# Altium schematic sheet FPGA Power.SchDoc
size A4
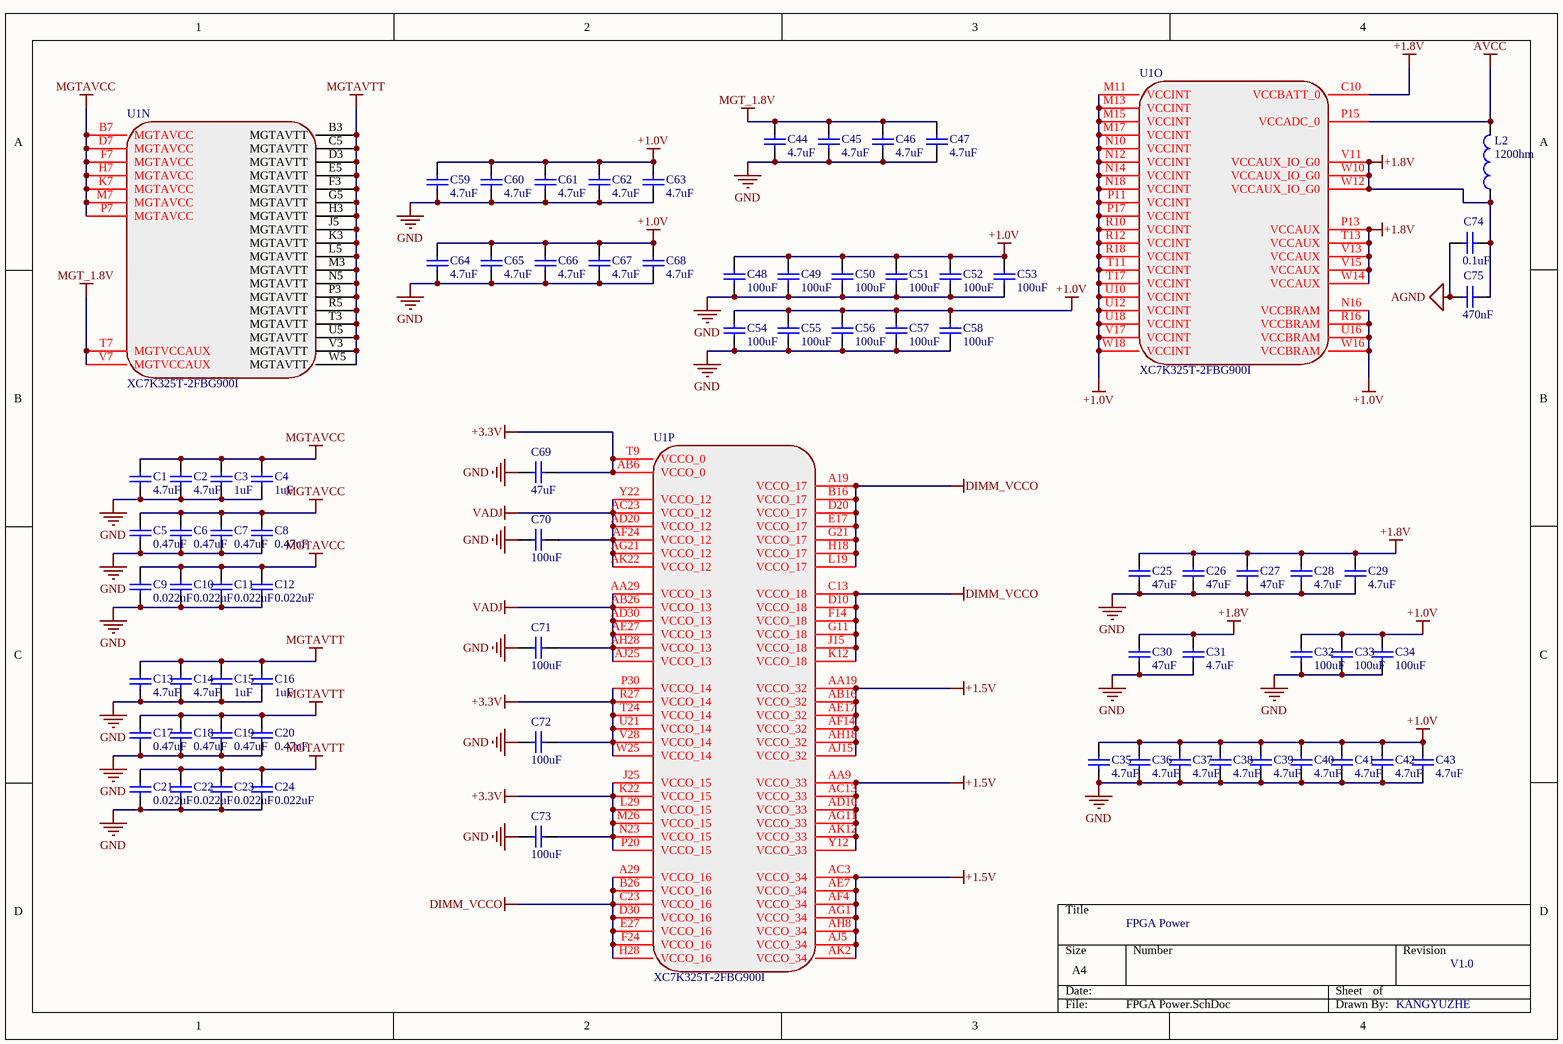
[diagram p0: FPGA Power.SchDoc]

## Parts
C1  value 4.7uF  [0402]  (hidden comment: Cap Semi)
C2  value 4.7uF  [0402]  (hidden comment: Cap Semi)
C3  value 1uF  [0402]  (hidden comment: Cap Semi)
C4  value 1uF  [0402]  (hidden comment: Cap Semi)
C5  value 0.47uF  [0402]  (hidden comment: Cap Semi)
C6  value 0.47uF  [0402]  (hidden comment: Cap Semi)
C7  value 0.47uF  [0402]  (hidden comment: Cap Semi)
C8  value 0.47uF  [0402]  (hidden comment: Cap Semi)
C9  value 0.022uF  [0402]  (hidden comment: Cap Semi)
C10  value 0.022uF  [0402]  (hidden comment: Cap Semi)
C11  value 0.022uF  [0402]  (hidden comment: Cap Semi)
C12  value 0.022uF  [0402]  (hidden comment: Cap Semi)
C13  value 4.7uF  [0402]  (hidden comment: Cap Semi)
C14  value 4.7uF  [0402]  (hidden comment: Cap Semi)
C15  value 1uF  [0402]  (hidden comment: Cap Semi)
C16  value 1uF  [0402]  (hidden comment: Cap Semi)
C17  value 0.47uF  [0402]  (hidden comment: Cap Semi)
C18  value 0.47uF  [0402]  (hidden comment: Cap Semi)
C19  value 0.47uF  [0402]  (hidden comment: Cap Semi)
C20  value 0.47uF  [0402]  (hidden comment: Cap Semi)
C21  value 0.022uF  [0402]  (hidden comment: Cap Semi)
C22  value 0.022uF  [0402]  (hidden comment: Cap Semi)
C23  value 0.022uF  [0402]  (hidden comment: Cap Semi)
C24  value 0.022uF  [0402]  (hidden comment: Cap Semi)
C25  value 47uF  [0402]  (hidden comment: Cap Semi)
C26  value 47uF  [0402]  (hidden comment: Cap Semi)
C27  value 47uF  [0402]  (hidden comment: Cap Semi)
C28  value 4.7uF  [0402]  (hidden comment: Cap Semi)
C29  value 4.7uF  [0402]  (hidden comment: Cap Semi)
C30  value 47uF  [0402]  (hidden comment: Cap Semi)
C31  value 4.7uF  [0402]  (hidden comment: Cap Semi)
C32  value 100uF  [0402]  (hidden comment: Cap Semi)
C33  value 100uF  [0402]  (hidden comment: Cap Semi)
C34  value 100uF  [0402]  (hidden comment: Cap Semi)
C35  value 4.7uF  [0402]  (hidden comment: Cap Semi)
C36  value 4.7uF  [0402]  (hidden comment: Cap Semi)
C37  value 4.7uF  [0402]  (hidden comment: Cap Semi)
C38  value 4.7uF  [0402]  (hidden comment: Cap Semi)
C39  value 4.7uF  [0402]  (hidden comment: Cap Semi)
C40  value 4.7uF  [0402]  (hidden comment: Cap Semi)
C41  value 4.7uF  [0402]  (hidden comment: Cap Semi)
C42  value 4.7uF  [0402]  (hidden comment: Cap Semi)
C43  value 4.7uF  [0402]  (hidden comment: Cap Semi)
C44  value 4.7uF  [0402]  (hidden comment: Cap Semi)
C45  value 4.7uF  [0402]  (hidden comment: Cap Semi)
C46  value 4.7uF  [0402]  (hidden comment: Cap Semi)
C47  value 4.7uF  [0402]  (hidden comment: Cap Semi)
C48  value 100uF  [0402]  (hidden comment: Cap Semi)
C49  value 100uF  [0402]  (hidden comment: Cap Semi)
C50  value 100uF  [0402]  (hidden comment: Cap Semi)
C51  value 100uF  [0402]  (hidden comment: Cap Semi)
C52  value 100uF  [0402]  (hidden comment: Cap Semi)
C53  value 100uF  [0402]  (hidden comment: Cap Semi)
C54  value 100uF  [0402]  (hidden comment: Cap Semi)
C55  value 100uF  [0402]  (hidden comment: Cap Semi)
C56  value 100uF  [0402]  (hidden comment: Cap Semi)
C57  value 100uF  [0402]  (hidden comment: Cap Semi)
C58  value 100uF  [0402]  (hidden comment: Cap Semi)
C59  value 4.7uF  [0402]  (hidden comment: Cap Semi)
C60  value 4.7uF  [0402]  (hidden comment: Cap Semi)
C61  value 4.7uF  [0402]  (hidden comment: Cap Semi)
C62  value 4.7uF  [0402]  (hidden comment: Cap Semi)
C63  value 4.7uF  [0402]  (hidden comment: Cap Semi)
C64  value 4.7uF  [0402]  (hidden comment: Cap Semi)
C65  value 4.7uF  [0402]  (hidden comment: Cap Semi)
C66  value 4.7uF  [0402]  (hidden comment: Cap Semi)
C67  value 4.7uF  [0402]  (hidden comment: Cap Semi)
C68  value 4.7uF  [0402]  (hidden comment: Cap Semi)
C69  value 47uF  [0402]  (hidden comment: Cap Semi)
C70  value 100uF  [0402]  (hidden comment: Cap Semi)
C71  value 100uF  [0402]  (hidden comment: Cap Semi)
C72  value 100uF  [0402]  (hidden comment: Cap Semi)
C73  value 100uF  [0402]  (hidden comment: Cap Semi)
C74  value 0.1uF  [0402]  (hidden comment: Cap Semi)
C75  value 470nF  [0402]  (hidden comment: Cap Semi)
L2  value 1200hm  [0402-A]  (hidden comment: Inductor)
U1  XC7K325T-2FBG900I  (parts N,O,P of 17)

## Nets
+1.0V: C32.2 C33.2 C34.2 C35.2 C36.2 C37.2 C38.2 C39.2 C40.2 C41.2 C42.2 C43.2 C48.2 C49.2 C50.2 C51.2 C52.2 C53.2 C54.2 C55.2 C56.2 C57.2 C58.2 C59.2 C60.2 C61.2 C62.2 C63.2 C64.2 C65.2 C66.2 C67.2 C68.2 U1.M11(VCCINT) U1.M13(VCCINT) U1.M15(VCCINT) U1.M17(VCCINT) U1.N10(VCCINT) U1.N12(VCCINT) U1.N14(VCCINT) U1.N16(VCCBRAM) U1.N18(VCCINT) U1.P11(VCCINT) U1.P17(VCCINT) U1.R10(VCCINT) U1.R12(VCCINT) U1.R16(VCCBRAM) U1.R18(VCCINT) U1.T11(VCCINT) U1.T17(VCCINT) U1.U10(VCCINT) U1.U12(VCCINT) U1.U16(VCCBRAM) U1.U18(VCCINT) U1.V17(VCCINT) U1.W16(VCCBRAM) U1.W18(VCCINT)
+1.5V: U1.AA9(VCCO_33) U1.AA19(VCCO_32) U1.AB16(VCCO_32) U1.AC3(VCCO_34) U1.AC13(VCCO_33) U1.AD10(VCCO_33) U1.AE7(VCCO_34) U1.AE17(VCCO_32) U1.AF4(VCCO_34) U1.AF14(VCCO_32) U1.AG1(VCCO_34) U1.AG11(VCCO_33) U1.AH8(VCCO_34) U1.AH18(VCCO_32) U1.AJ5(VCCO_34) U1.AJ15(VCCO_32) U1.AK2(VCCO_34) U1.AK12(VCCO_33) U1.Y12(VCCO_33)
+1.8V: C25.2 C26.2 C27.2 C28.2 C29.2 C30.2 C31.2 C74.2 C75.2 L2.1 U1.C10(VCCBATT_0) U1.P13(VCCAUX) U1.T13(VCCAUX) U1.V11(VCCAUX_IO_G0) U1.V13(VCCAUX) U1.V15(VCCAUX) U1.W10(VCCAUX_IO_G0) U1.W12(VCCAUX_IO_G0) U1.W14(VCCAUX)
+3.3V: C69.2 C72.2 C73.2 U1.AB6(VCCO_0) U1.J25(VCCO_15) U1.K22(VCCO_15) U1.L29(VCCO_15) U1.M26(VCCO_15) U1.N23(VCCO_15) U1.P20(VCCO_15) U1.P30(VCCO_14) U1.R27(VCCO_14) U1.T9(VCCO_0) U1.T24(VCCO_14) U1.U21(VCCO_14) U1.V28(VCCO_14) U1.W25(VCCO_14)
AGND: C74.1 C75.1
AVCC: L2.2 U1.P15(VCCADC_0)
DIMM_VCCO: U1.A19(VCCO_17) U1.A29(VCCO_16) U1.B16(VCCO_17) U1.B26(VCCO_16) U1.C13(VCCO_18) U1.C23(VCCO_16) U1.D10(VCCO_18) U1.D20(VCCO_17) U1.D30(VCCO_16) U1.E17(VCCO_17) U1.E27(VCCO_16) U1.F14(VCCO_18) U1.F24(VCCO_16) U1.G11(VCCO_18) U1.G21(VCCO_17) U1.H18(VCCO_17) U1.H28(VCCO_16) U1.J15(VCCO_18) U1.K12(VCCO_18) U1.L19(VCCO_17)
GND: C1.2 C2.1 C3.1 C4.1 C5.1 C6.1 C7.1 C8.1 C9.1 C10.1 C11.1 C12.1 C13.2 C14.1 C15.1 C16.1 C17.1 C18.1 C19.1 C20.1 C21.1 C22.1 C23.1 C24.1 C25.1 C26.1 C27.1 C28.1 C29.1 C30.1 C31.1 C32.1 C33.1 C34.1 C35.1 C36.1 C37.1 C38.1 C39.1 C40.1 C41.1 C42.1 C43.1 C44.1 C45.1 C46.1 C47.1 C48.1 C49.1 C50.1 C51.1 C52.1 C53.1 C54.1 C55.1 C56.1 C57.1 C58.1 C59.1 C60.1 C61.1 C62.1 C63.1 C64.1 C65.1 C66.1 C67.1 C68.1 C69.1 C70.1 C71.1 C72.1 C73.1
MGT_1.8V: C44.2 C45.2 C46.2 C47.2 U1.T7(MGTVCCAUX) U1.V7(MGTVCCAUX)
MGTAVCC: C1.1 C2.2 C3.2 C4.2 C5.2 C6.2 C7.2 C8.2 C9.2 C10.2 C11.2 C12.2 U1.B7(MGTAVCC) U1.D7(MGTAVCC) U1.F7(MGTAVCC) U1.H7(MGTAVCC) U1.K7(MGTAVCC) U1.M7(MGTAVCC) U1.P7(MGTAVCC)
MGTAVTT: C13.1 C14.2 C15.2 C16.2 C17.2 C18.2 C19.2 C20.2 C21.2 C22.2 C23.2 C24.2 U1.B3(MGTAVTT) U1.C5(MGTAVTT) U1.D3(MGTAVTT) U1.E5(MGTAVTT) U1.F3(MGTAVTT) U1.G5(MGTAVTT) U1.H3(MGTAVTT) U1.J5(MGTAVTT) U1.K3(MGTAVTT) U1.L5(MGTAVTT) U1.M3(MGTAVTT) U1.N5(MGTAVTT) U1.P3(MGTAVTT) U1.R5(MGTAVTT) U1.T3(MGTAVTT) U1.U5(MGTAVTT) U1.V3(MGTAVTT) U1.W5(MGTAVTT)
VADJ: C70.2 C71.2 U1.AA29(VCCO_13) U1.AB26(VCCO_13) U1.AC23(VCCO_12) U1.AD20(VCCO_12) U1.AD30(VCCO_13) U1.AE27(VCCO_13) U1.AF24(VCCO_12) U1.AG21(VCCO_12) U1.AH28(VCCO_13) U1.AJ25(VCCO_13) U1.AK22(VCCO_12) U1.Y22(VCCO_12)

## Notes on the sheet
- FPGA Power
- V1.0
- KANGYUZHE

## Library data of the parts
C1-C75 = Cap Semi: Capacitor (Semiconductor SIM Model); Published: 8-Jun-2000; LatestRevisionDate: 29-May-2009; LatestRevisionNote: IPC-7351 Footprint Added.; PackageReference: C1206; Publisher: Altium Limited; PackageDescription: Chip Capacitor
L2 = Inductor: Code_IEC: 1005; Published: 8-Jun-2000; LatestRevisionDate: 29-May-2009; LatestRevisionNote: IPC-7351 Footprint Added.; PackageReference: 0402-A; Publisher: Altium Limited; PackageDescription: Chip Inductor; Code_JEITA: 0402